# EasyEDA schematic SCH_swissarmyknife_2024-05-07.json
TITLE: Sheet_1; REV: 1.0; Date: 2024-05-07; Sheet: 1/1; Drawn By: earthrat123; Company: Your Company
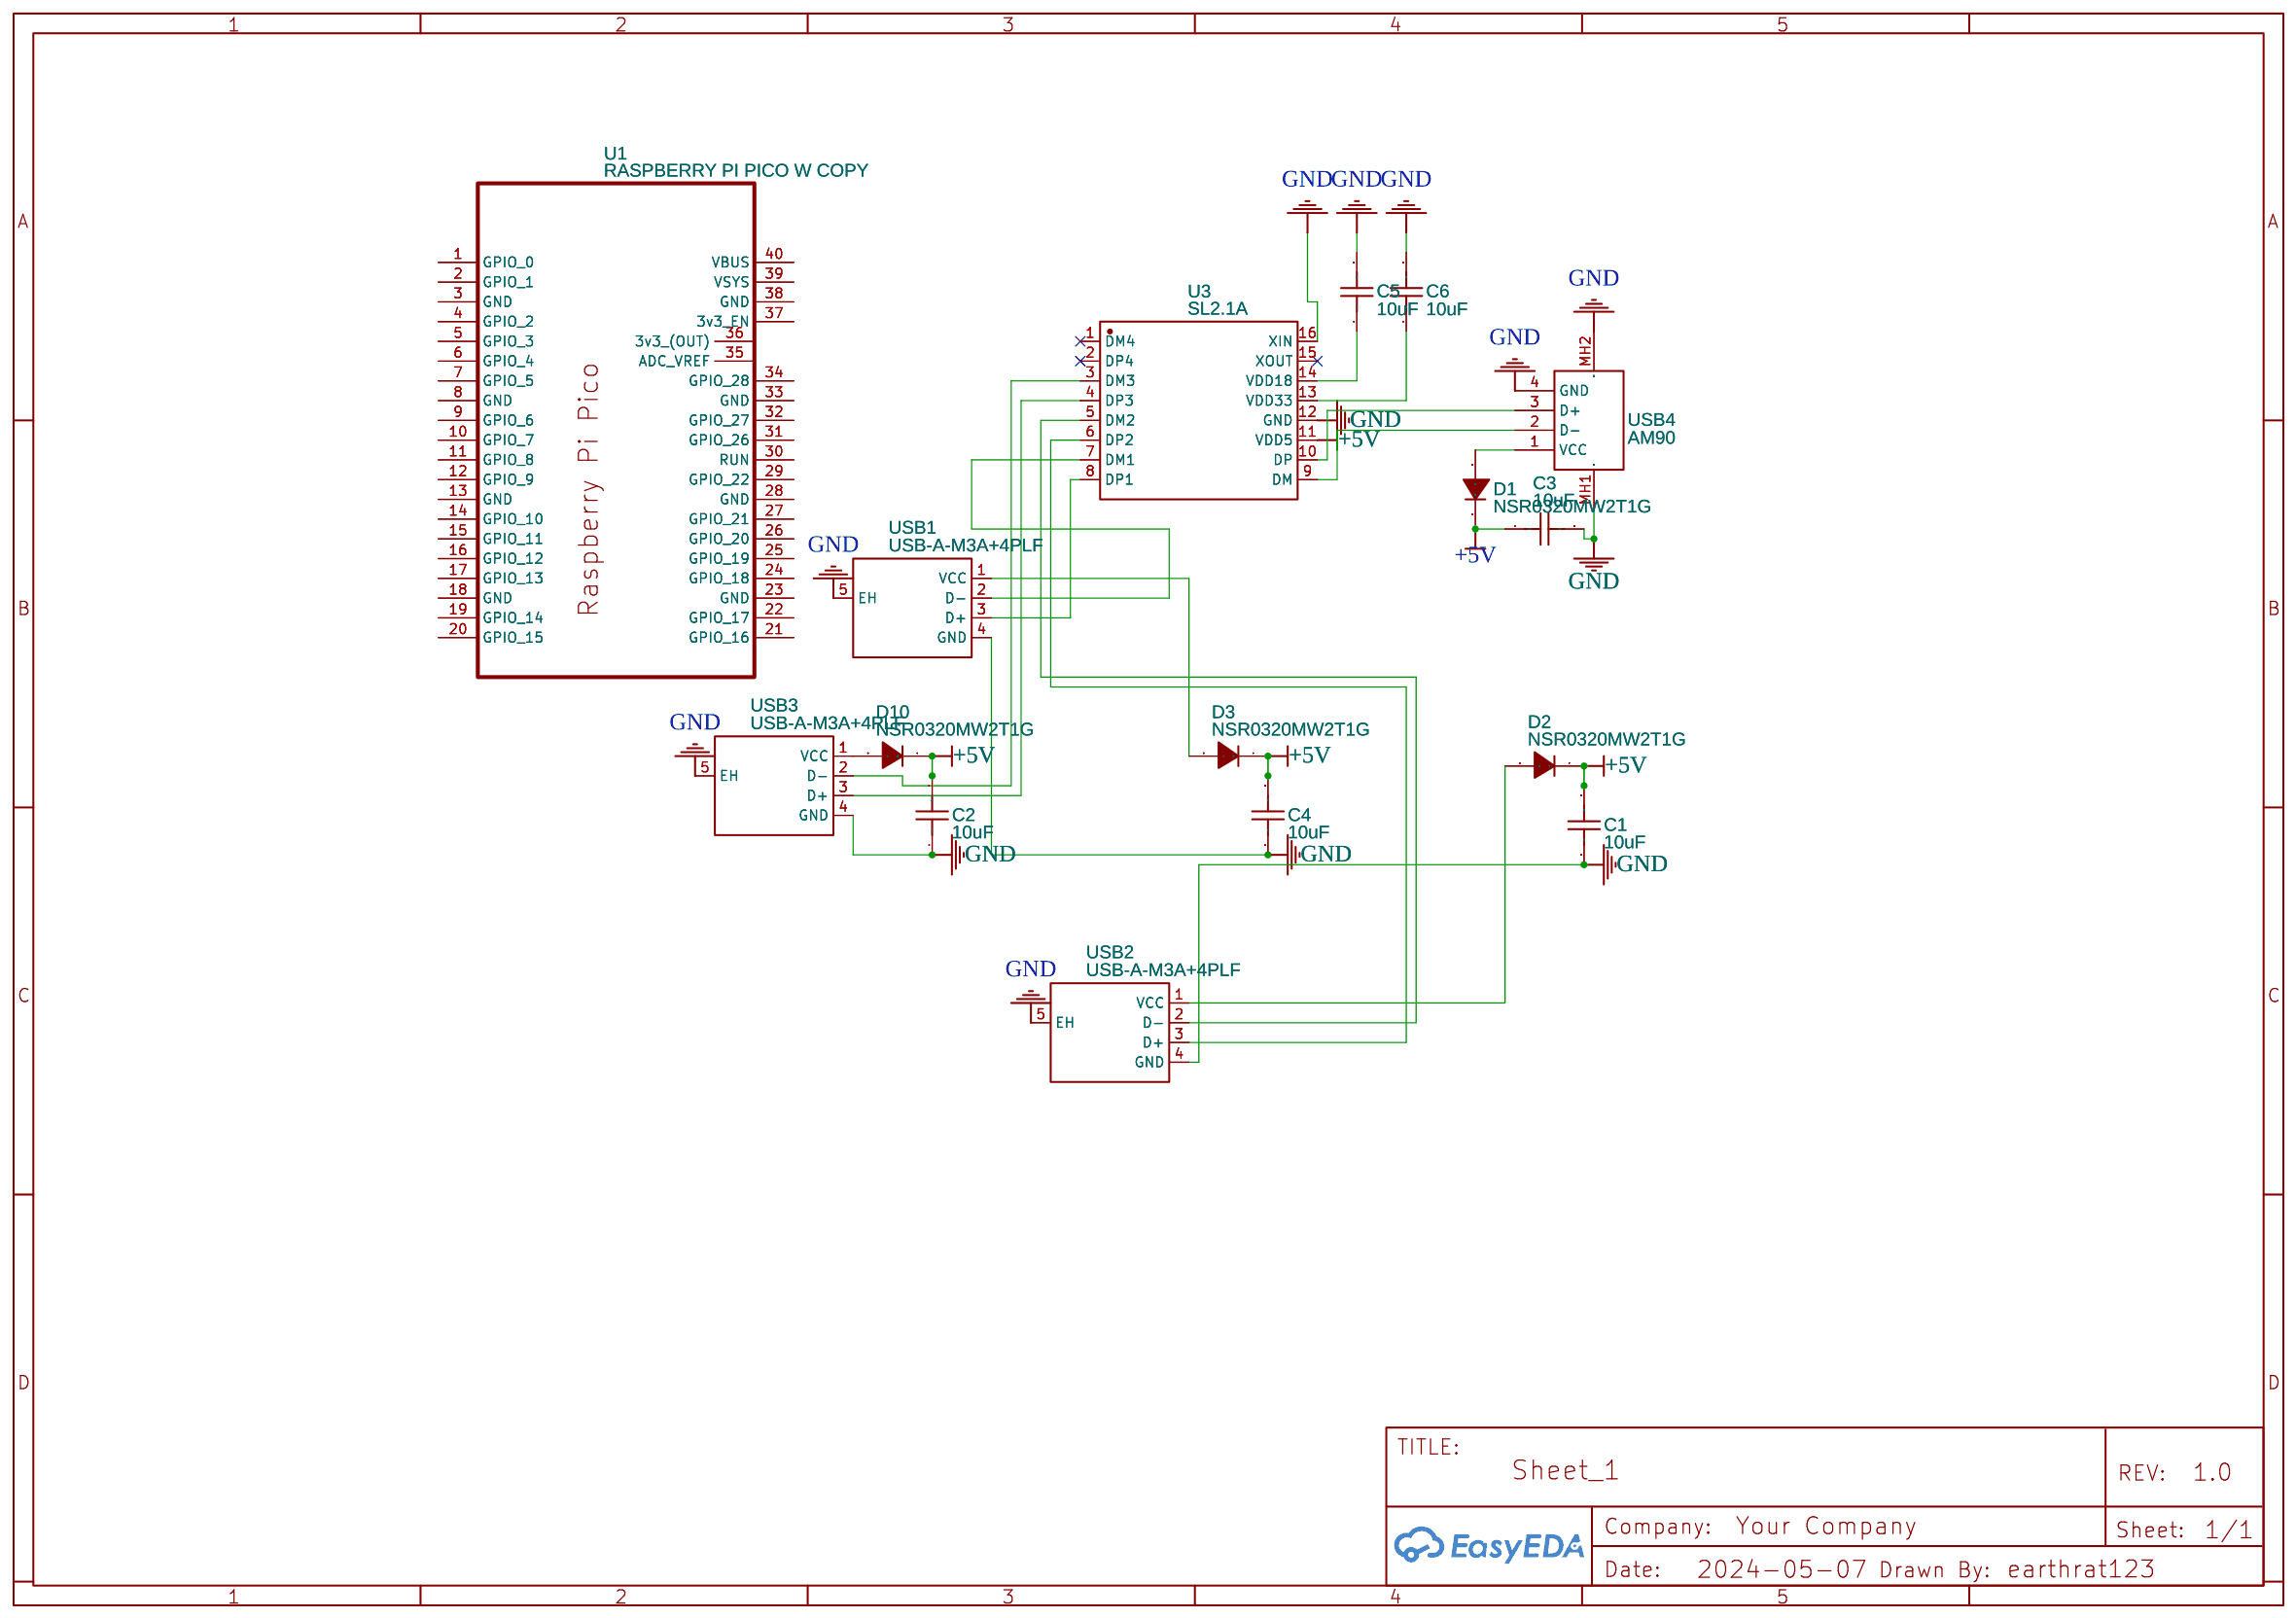
[diagram p0: schematic sheet]

## Parts
C1  10uF  [C0603]
C2  10uF  [C0603]
C3  10uF  [C0603]
C4  10uF  [C0603]
C5  10uF  [C0603]
C6  10uF  [C0603]
D1  NSR0320MW2T1G  [SOD-323_L1.8-W1.3-LS2.5-RD]
D2  NSR0320MW2T1G  [SOD-323_L1.8-W1.3-LS2.5-RD]
D3  NSR0320MW2T1G  [SOD-323_L1.8-W1.3-LS2.5-RD]
D10  NSR0320MW2T1G  [SOD-323_L1.8-W1.3-LS2.5-RD]
U1  RASPBERRY PI PICO W COPY  [RASPBERRY PI PICO/ RASPBERRY PI PICO W]
U3  SL2.1A  [SOP-16_L10.0-W3.9-P1.27-LS6.0-BL]
USB1  USB-A-M3A+4PLF  [USB-A-TH_USB-A-M3A-4PLF]
USB2  USB-A-M3A+4PLF  [USB-A-TH_USB-A-M3A-4PLF]
USB3  USB-A-M3A+4PLF  [USB-A-TH_USB-A-M3A-4PLF]
USB4  AM90  [USB-AM-TH_AM90]

## Library data of the parts
C1-C6 = CL10A106KP8NNNC: Supplier: LCSC; Manufacturer: SAMSUNG(三星); Supplier Part: C19702; JLCPCB Part Class: Basic Part
D1-D3 D10 = NSR0320MW2T1G: Supplier: LCSC; Manufacturer: onsemi(安森美); Supplier Part: C48192; JLCPCB Part Class: Extended Part
U1 = RASPBERRY PI PICO W COPY: Contributor: timothe.etique
U3 = SL2.1A: Contributor: LCSC; Supplier: LCSC; Supplier Part: C192893; Manufacturer: CoreChips(和芯润德); JLCPCB Part Class: Extended Part
USB1-USB3 = USB-A-M3A+4PLF: Contributor: LCSC; Supplier: LCSC; Supplier Part: C718032; Manufacturer: JINJIA(金佳); JLCPCB Part Class: Extended Part
USB4 = AM90: Contributor: LCSC; Supplier: LCSC; Supplier Part: C404965; Manufacturer: SHOU HAN(首韩); JLCPCB Part Class: Extended Part

## Nets
+5V: C1.2 C2.2 C3.1 C4.2 D1.1(C) D2.1(C) D3.1(C) D10.1(C) U3.11(VDD5)
GND: C1.1 C2.1 C3.2 C4.1 C5.2 C6.2 U3.12(GND) U3.16(XIN) USB1.4(GND) USB1.5(EH) USB2.4(GND) USB2.5(EH) USB3.4(GND) USB3.5(EH) USB4.4(GND) USB4.MH1 USB4.MH2
Net-(C5-1): C5.1 U3.14(VDD18)
Net-(C6-1): C6.1 U3.13(VDD33)
Net-(D1-2): D1.2(A) USB4.1(VCC)
Net-(D2-2): D2.2(A) USB2.1(VCC)
Net-(D3-2): D3.2(A) USB1.1(VCC)
Net-(D10-2): D10.2(A) USB3.1(VCC)
Net-(U3-3): U3.3(DM3) USB3.2(D-)
Net-(U3-4): U3.4(DP3) USB3.3(D+)
Net-(U3-5): U3.5(DM2) USB2.2(D-)
Net-(U3-6): U3.6(DP2) USB2.3(D+)
Net-(U3-7): U3.7(DM1) USB1.2(D-)
Net-(U3-8): U3.8(DP1) USB1.3(D+)
Net-(U3-9): U3.9(DM) USB4.2(D-)
Net-(U3-10): U3.10(DP) USB4.3(D+)

Not connected (* = marked no-connect by the designer): U1 1(GPIO 0) 2(GPIO 1) 3(GND) 4(GPIO 2) 5(GPIO 3) 6(GPIO 4) 7(GPIO 5) 8(GND) 9(GPIO 6) 10(GPIO 7) 11(GPIO 8) 12(GPIO 9) 13(GND) 14(GPIO 10) 15(GPIO 11) 16(GPIO 12) 17(GPIO 13) 18(GND) 19(GPIO 14) 20(GPIO 15) 21(GPIO 16) 22(GPIO 17) 23(GND) 24(GPIO 18) 25(GPIO 19) 26(GPIO 20) 27(GPIO 21) 28(GND) 29(GPIO 22) 30(RUN) 31(GPIO 26) 32(GPIO 27) 33(GND) 34(GPIO 28) 35(ADC_VREF) 36(3v3 (OUT)) 37(3v3_EN) 38(GND) 39(VSYS) 40(VBUS); U3 1(DM4)* 2(DP4)* 15(XOUT)*
